# Altium schematic sheet 11-SPI.SchDoc
size A4; DocumentNumber: 24; SheetNumber: 24; SheetTotal: 34
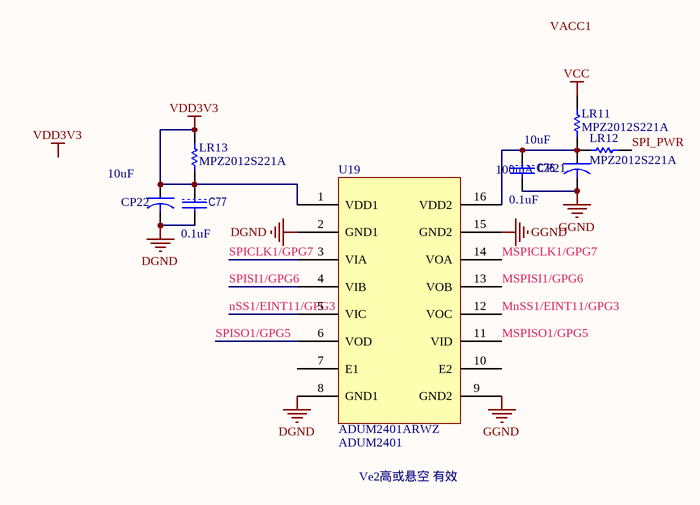
[diagram p0: 11-SPI.SchDoc]

## Parts
C76  value 0.1uF  [1608[0603]C]  (hidden comment: C1608X7R1H104K)
C77  value 0.1uF  [1608[0603]C]  (hidden comment: C1608X7R1H104K)
CP21  value 10uF  [3216[1206]CB]  (hidden comment: TAJA106K016RNJ)
CP22  value 10uF  [3216[1206]CB]  (hidden comment: TAJA106K016RNJ)
LR11  MPZ2012S221A  [2012[0805]]
LR12  MPZ2012S221A  [2012[0805]]
LR13  MPZ2012S221A  [2012[0805]]
U19  ADUM2401ARWZ  [SOIC16W_N]

## Nets
DGND: C77.2 CP22.2 U19.2(GND1) U19.8(GND1)
GGND: C76.2 CP21.2 U19.9(GND2) U19.15(GND2)
VCC: LR11.2
VDD3V3: C77.1 CP22.1 LR13.1 LR13.2 U19.1(VDD1)
MnSS1/EINT11/GPG3: U19.12(VOC)
MSPICLK1/GPG7: U19.14(VOA)
MSPISI1/GPG6: U19.13(VOB)
MSPISO1/GPG5: U19.11(VID)
nSS1/EINT11/GPG3: U19.5(VIC)
SPI_PWR: LR12.1
SPICLK1/GPG7: U19.3(VIA)
SPISI1/GPG6: U19.4(VIB)
SPISO1/GPG5: U19.6(VOD)
NetC76_1: C76.1 CP21.1 LR11.1 LR12.2 U19.16(VDD2)

Not connected (* = marked no-connect by the designer): U19 7(E1) 10(E2)

## Notes on the sheet
- (near C76) 100mA
- Ve2高或悬空 有效
- Labels drawn without touching a wire or pin: VACC1, VDD3V3

## Library data of the parts
C76 C77 = CAP: 多层陶瓷电容器MLCC - SMD/SMT 0603 0.1uF 50volts X7R 10%; Manufacturer: TDK; 产品: General Type MLCCs; 产品种类: Low & Medium Capacitance SMD Ceramic Chip Capacitors; 外壳代码 - in: 0603; 外壳代码 - mm: 1608; 封装 / 箱体: 0603 (1608 metric); 封装: Reel; 尺寸: 0.8 mm W x 1.6 mm L x 0.8 mm H; 工作温度范围: - 55 C to + 125 C; 标准包装数量: 4000; 电压额定值: 50 V; 电容-nF: 100 nF; 电容-pF: 100000 pF; 系列: C; Category: 多层陶瓷电容器MLCC - SMD/SMT; ComponentLink1Description: http://www.tdk.com/pdf/general_B11.pdf; ComponentLink1URL: http://www.tdk.com/pdf/general_B11.pdf; Description 1: 多层陶瓷电容器MLCC - SMD/SMT 0603 0.1uF 50volts X7R 10%; Manufacturer Part Number: C1608X7R1H104K; Minimum Order Quantity: 1; Pricing 1: 1=0.160, 50=0.070, 100=0.036, 500=0.019, 1000=0.013, 4000=0.010, 8000=0.009, 12000=0.008, 20000=0.007 (USD); Reeling: True; RoHS - 贸泽: Y; RoHS: RoHS Compliant; Stock 1: 224604; Supplier 1: Mouser; Supplier Part Number 1: 810-C1608X7R1H104K; 制造商: TDK; 容差: 10 %; 温度系数/代码: X7R; 电容: 0.1 uF; 端接类型: SMD/SMT
CP21 CP22 = CAPACITOR: 钽质电容器-固体SMD 16volts 10uF 10%; Manufacturer: AVX; ESR: 3 Ohms; 产品: Tantalum Solid Standard Grade - Other Various; 产品种类: SMD Tantalum Capacitors; 制造商库存号: A Case; 外壳代码 - in: 1206; 外壳代码 - mm: 3216; 封装 / 箱体: 1206 (3216 metric); 封装: Reel; 尺寸: 1.6 mm W x 3.2 mm L; 工作温度范围: - 55 C to + 125 C; 损耗因数 DF: 8; 标准包装数量: 2000; 漏泄电流: 1.6 uA; 电压额定值: 16 V; 端接类型: SMD/SMT; 系列: TAJ; 高度: 1.8 mm; Category: 钽质电容器-固体SMD; ComponentLink1Description: http://www.avx.com/docs/Catalogs/taj.pdf; ComponentLink1URL: http://www.avx.com/docs/Catalogs/taj.pdf; Description 1: 钽质电容器-固体SMD 16volts 10uF 10%; Manufacturer Part Number: TAJA106K016RNJ; Minimum Order Quantity: 1; Pricing 1: 1=0.600, 100=0.280, 200=0.250, 500=0.221, 1000=0.200, 2000=0.140, 5000=0.131, 10000=0.124, 25000=0.103 (USD); Reeling: True; RoHS - 贸泽: Y; RoHS: RoHS Compliant; Stock 1: 20335; Supplier 1: Mouser; Supplier Part Number 1: 581-TAJA106K016R; 制造商: AVX; 容差: 10 %; 电容: 10 uF
LR11-LR13 = Res Semi: 电磁干扰滤波珠子、扼流圈和阵列 Ferrite Chip Beads; Manufacturer: TDK; 阻抗: 220 Ohms; 最大直流电流: 3 A; 最大直流电阻: 0.04 Ohms; 工作温度范围: - 55 C to + 125 C; 封装 / 箱体: 2012; 封装: Reel; 端接类型: SMD/SMT; 容差: 25 %; 产品种类: Ferrite Beads; 标准包装数量: 4000; Supplier 1: Mouser; Supplier Part Number 1: 810-MPZ2012S221A; Manufacturer Part Number: MPZ2012S221A; RoHS: RoHS Compliant; Description 1: 电磁干扰滤波珠子、扼流圈和阵列 Ferrite Chip Beads; Category: 电磁干扰滤波珠子、扼流圈和阵列; Stock 1: 26540; Pricing 1: 1=0.070, 50=0.060, 100=0.053, 500=0.040, 1000=0.035, 4000=0.031, 8000=0.029, 12000=0.025 (USD); 制造商: TDK; RoHS - 贸泽: Y; Minimum Order Quantity: 1; Reeling: True; ComponentLink1URL: http://www.mouser.com/ds/2/400/e9413_mpz-24582.pdf; ComponentLink1Description: http://www.mouser.com/ds/2/400/e9413_mpz-24582.pdf
U19 = ADuM2401: ADuM2401 1IN 3OUT; Manufacturer: Analog Devices; Isolation Voltage: 846 V; Supply Current: 0.53 mA; Number of Channels: 4 Channel; Number of Input Lines: 3; Maximum Data Rate: 1 Mbps; Propagation Delay Time: 32 ns; Supply Voltage - Max: 5.5 V; Supply Voltage - Min: 2.7 V; Product Status: New at Mouser; Supplier 1: Mouser; Manufacturer Part Number: ADUM2401ARWZ; RoHS: RoHS Compliant; Category: Isolator Interface IC; Stock 1: 339; Pricing 1: 1=9.54, 10=8.59, 25=7.82, 50=7.29, 100=7.06, 250=6.48, 500=5.91, 1000=5.16, 2500=5.09 (AUD); Package / Case: SOIC-16; Packaging: Tube; Mounting Style: SMD/SMT; Maximum Operating Temperature: + 105 C; Minimum Operating Temperature: - 40 C; Standard Pack Qty: 47; RoHS - Mouser: Y; Minimum Order Quantity: 1; Reeling: False; ComponentLink1URL: http://www.analog.com/static/imported-files/data_sheets/ADuM2400_2401_2402.pdf; ComponentLink1Description: http://www.analog.com/static/imported-files/data_sheets/ADuM2400_2401_2402.pdf; Supplier Part Number 1: 584-ADUM2401ARWZ; Series: ADUM2401